# EAGLE schematic Projeto_Relogio_LED (EAGLE 9.6.2)
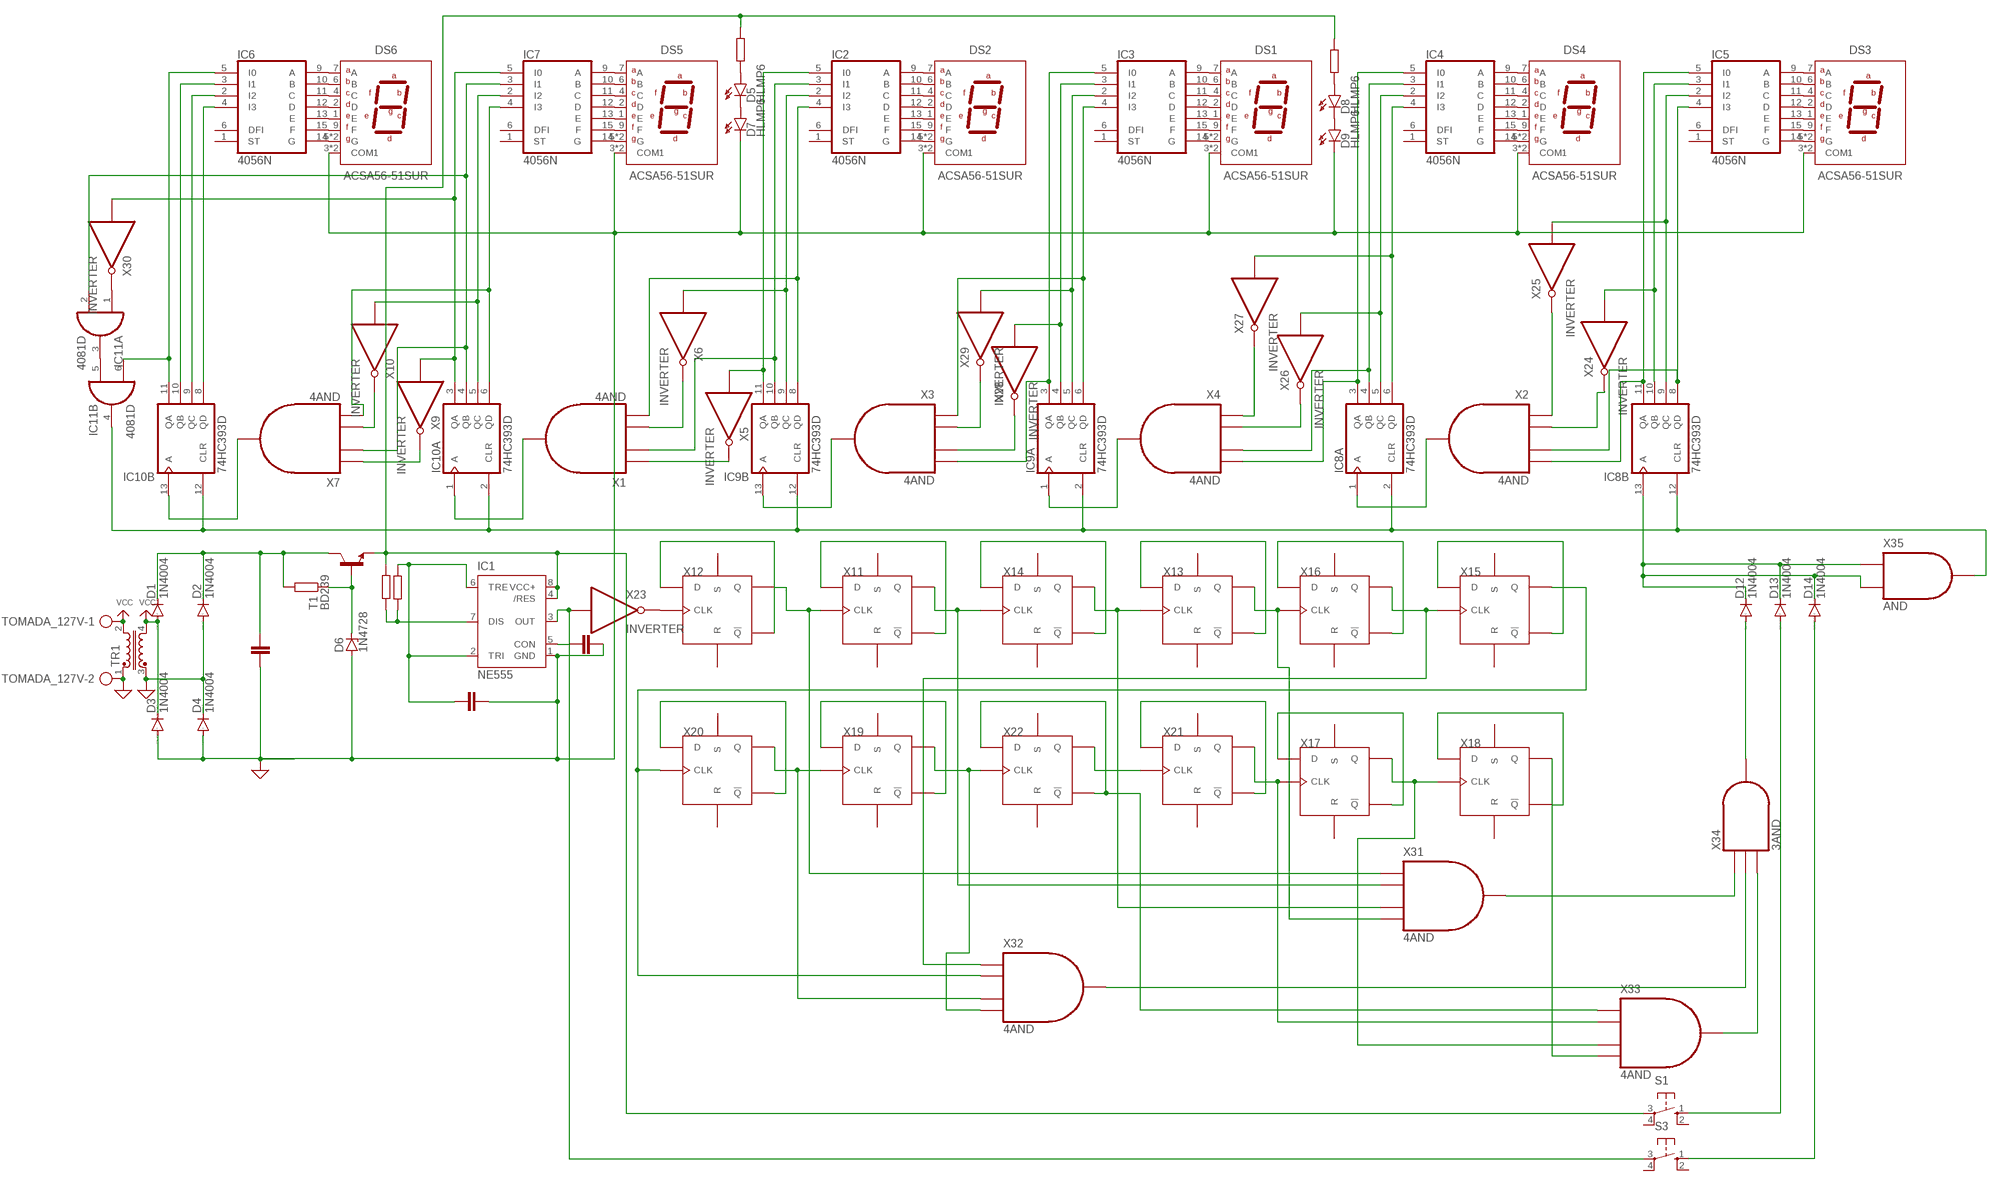
[diagram p0: schematic, sheet 1]

## Parts
D1  1N4004  [DO41-10]
D2  1N4004  [DO41-10]
D3  1N4004  [DO41-10]
D4  1N4004  [DO41-10]
D5  HLMP6  [HLMP6]
D6  1N4728  [DO41Z10]
D7  HLMP6  [HLMP6]
D8  HLMP6  [HLMP6]
D9  HLMP6  [HLMP6]
D12  1N4004  [DO41-10]
D13  1N4004  [DO41-10]
D14  1N4004  [DO41-10]
DS1  ACSA56-51SUR  [ACSA56-51SURKWA]
DS2  ACSA56-51SUR  [ACSA56-51SURKWA]
DS3  ACSA56-51SUR  [ACSA56-51SURKWA]
DS4  ACSA56-51SUR  [ACSA56-51SURKWA]
DS5  ACSA56-51SUR  [ACSA56-51SURKWA]
DS6  ACSA56-51SUR  [ACSA56-51SURKWA]
IC1  NE555  [DIL-08]
IC2  4056N  [DIL16]
IC3  4056N  [DIL16]
IC4  4056N  [DIL16]
IC5  4056N  [DIL16]
IC6  4056N  [DIL16]
IC7  4056N  [DIL16]
IC8  74HC393D  [SO14]
IC9  74HC393D  [SO14]
IC10  74HC393D  [SO14]
IC11  4081D  [SO14]
S1  10-XX  [B3F-10XX]
S3  10-XX  [B3F-10XX]
T1  BD239  [TO220]
TOMADA_127V  AK500/2-H  [AK500/2-H]
TR1  U15-TRANSFORMER  [U15]
X1  4AND  (no package)
X2  4AND  (no package)
X3  4AND  (no package)
X4  4AND  (no package)
X5  INVERTER  (no package)
X6  INVERTER  (no package)
X7  4AND  (no package)
X9  INVERTER  (no package)
X10  INVERTER  (no package)
X11  DFF  (no package)
X12  DFF  (no package)
X13  DFF  (no package)
X14  DFF  (no package)
X15  DFF  (no package)
X16  DFF  (no package)
X17  DFF  (no package)
X18  DFF  (no package)
X19  DFF  (no package)
X20  DFF  (no package)
X21  DFF  (no package)
X22  DFF  (no package)
X23  INVERTER  (no package)
X24  INVERTER  (no package)
X25  INVERTER  (no package)
X26  INVERTER  (no package)
X27  INVERTER  (no package)
X28  INVERTER  (no package)
X29  INVERTER  (no package)
X30  INVERTER  (no package)
X31  4AND  (no package)
X32  4AND  (no package)
X33  4AND  (no package)
X34  3AND  (no package)
X35  AND  (no package)

## Nets
GND: D2.A D3.A D4.A D4.C D6.A D7.K D9.K DS1.3(COM1) DS1.8(COM1) DS2.3(COM1) DS2.8(COM1) DS3.3(COM1) DS3.8(COM1) DS4.3(COM1) DS4.8(COM1) DS5.3(COM1) DS5.8(COM1) DS6.3(COM1) DS6.8(COM1) IC1.1(GND) TOMADA_127V.2 TR1.1 TR1.3 ; supply symbol labelled SUP
N$1: IC10.1(A:A) X1.Y
N$2: X1.A X5.O
N$3: IC8.1(A:A) X2.Y
N$4: D1.C D2.C T1.2(C)
N$5: IC1.7(DIS)
N$6: IC1.2(TRI) IC1.6(TRE)
N$7: D6.C T1.1(B)
N$8: IC1.5(CON)
N$9: IC1.3(OUT) S3.3(P) X23.I
N$10: X11.CLK X12.Q X31.A
N$11: X11.Q X14.CLK X31.B
N$12: X13.CLK X14.Q X31.C
N$13: X13.Q X16.CLK X31.D
N$14: X15.CLK X16.Q X32.A
N$15: X15.Q X20.CLK X32.B
N$16: X19.CLK X20.Q X32.C
N$17: X19.Q X22.CLK X32.D
N$18: X21.CLK X22.Q
N$19: X17.CLK X21.Q X33.B
N$20: X17.Q X18.CLK X33.C
N$21: DS5.7(A) IC7.9(A)
N$22: DS5.6(B) IC7.10(B)
N$23: DS5.4(C) IC7.11(C)
N$24: DS5.2(D) IC7.12(D)
N$25: DS5.1(E) IC7.13(E)
N$26: DS5.5(G) DS5.10(G) IC7.14(G)
N$27: DS5.9(F) IC7.15(F)
N$28: DS6.7(A) IC6.9(A)
N$29: DS6.6(B) IC6.10(B)
N$30: DS6.4(C) IC6.11(C)
N$31: DS6.2(D) IC6.12(D)
N$32: DS6.1(E) IC6.13(E)
N$33: DS6.5(G) DS6.10(G) IC6.14(G)
N$34: DS6.9(F) IC6.15(F)
N$35: DS3.7(A) IC5.9(A)
N$36: DS3.6(B) IC5.10(B)
N$37: DS3.4(C) IC5.11(C)
N$38: DS3.2(D) IC5.12(D)
N$39: DS3.1(E) IC5.13(E)
N$40: DS3.5(G) DS3.10(G) IC5.14(G)
N$41: DS3.9(F) IC5.15(F)
N$42: DS4.7(A) IC4.9(A)
N$43: DS4.6(B) IC4.10(B)
N$44: DS4.4(C) IC4.11(C)
N$45: DS4.2(D) IC4.12(D)
N$46: DS4.1(E) IC4.13(E)
N$47: DS4.5(G) DS4.10(G) IC4.14(G)
N$48: DS4.9(F) IC4.15(F)
N$49: DS1.7(A) IC3.9(A)
N$50: DS1.6(B) IC3.10(B)
N$51: DS1.4(C) IC3.11(C)
N$52: DS1.2(D) IC3.12(D)
N$53: DS1.1(E) IC3.13(E)
N$54: DS1.5(G) DS1.10(G) IC3.14(G)
N$55: DS1.9(F) IC3.15(F)
N$56: DS2.7(A) IC2.9(A)
N$57: DS2.6(B) IC2.10(B)
N$58: DS2.4(C) IC2.11(C)
N$59: DS2.2(D) IC2.12(D)
N$60: DS2.1(E) IC2.13(E)
N$61: DS2.5(G) DS2.10(G) IC2.14(G)
N$62: DS2.9(F) IC2.15(F)
N$63: IC4.4(I3) IC8.6(A:QD) X27.I
N$64: IC4.2(I2) IC8.5(A:QC) X26.I
N$65: IC4.3(I1) IC8.4(A:QB) X4.C
N$66: IC4.5(I0) IC8.3(A:QA) X4.D
N$67: IC5.4(I3) IC8.8(B:QD) X2.C
N$68: IC5.2(I2) IC8.9(B:QC) X25.I
N$69: IC5.3(I1) IC8.10(B:QB) X24.I
N$70: IC5.5(I0) IC8.11(B:QA) X2.D
N$71: IC3.4(I3) IC9.6(A:QD) X3.A
N$72: IC3.2(I2) IC9.5(A:QC) X29.I
N$73: IC3.3(I1) IC9.4(A:QB) X28.I
N$74: IC3.5(I0) IC9.3(A:QA) X3.D
N$75: IC2.4(I3) IC9.8(B:QD) X1.D
N$76: IC2.2(I2) IC9.9(B:QC) X6.I
N$77: IC2.3(I1) IC9.10(B:QB) X1.B
N$78: IC2.5(I0) IC9.11(B:QA) X5.I
N$79: IC7.4(I3) IC10.6(A:QD) X7.D
N$80: IC7.2(I2) IC10.5(A:QC) X10.I
N$81: IC7.3(I1) IC10.4(A:QB) IC11.2(A:I1) X7.B
N$82: IC7.5(I0) IC10.3(A:QA) X9.I X30.I
N$83: IC6.4(I3) IC10.8(B:QD)
N$84: IC6.2(I2) IC10.9(B:QC)
N$85: IC6.3(I1) IC10.10(B:QB)
N$86: IC6.5(I0) IC10.11(B:QA) IC11.6(B:I1)
N$87: D5.K D7.A
N$88: D8.K D9.A
N$89: X12.CLK X23.O
N$90: D12.A X34.Y
N$91: X1.C X6.O
N$92: X7.A X9.O
N$93: X12.!Q X12.D
N$94: X11.!Q X11.D
N$95: X14.!Q X14.D
N$96: X13.!Q X13.D
N$97: X16.!Q X16.D
N$98: X15.!Q X15.D
N$99: X18.!Q X18.D
N$100: X17.!Q X17.D
N$101: X21.!Q X21.D
N$102: X22.!Q X22.D X33.A
N$103: X20.!Q X20.D
N$104: X19.!Q X19.D
N$105: D12.C D13.C D14.C IC8.13(B:A) X35.A X35.B
N$106: X31.Y X34.A
N$107: IC1.4(/RES) IC1.8(VCC+) S1.3(P) T1.3(E)
N$108: D13.A S1.1(S)
N$109: D14.A S3.1(S)
N$110: X32.Y X34.B
N$111: IC8.2(A:CLR) IC8.12(B:CLR) IC9.2(A:CLR) IC9.12(B:CLR) IC10.2(A:CLR) IC10.12(B:CLR) IC11.4(B:O) X35.Y
N$112: X2.B X24.O
N$113: X2.A X25.O
N$114: IC9.1(A:A) X4.Y
N$115: X4.B X26.O
N$116: X4.A X27.O
N$117: IC9.13(B:A) X3.Y
N$118: X3.C X28.O
N$119: X3.B X29.O
N$120: IC11.1(A:I0) X30.O
N$121: X7.C X10.O
N$122: IC10.13(B:A) X7.Y
N$123: IC11.3(A:O) IC11.5(B:I0)
N$124: X33.Y X34.C
N$125: X18.Q X33.D
VCC: D1.A D3.C TOMADA_127V.1 TR1.2 TR1.4
Unconnected: D5.A D8.A IC2.1(ST) IC2.6(DFI) IC3.1(ST) IC3.6(DFI) IC4.1(ST) IC4.6(DFI) IC5.1(ST) IC5.6(DFI) IC6.1(ST) IC6.6(DFI) IC7.1(ST) IC7.6(DFI) IC11.8(C:I0) IC11.9(C:I1) IC11.10(C:O) IC11.11(D:O) IC11.12(D:I0) IC11.13(D:I1) S1.2(S1) S1.4(P1) S3.2(S1) S3.4(P1) X11.R X11.S X12.R X12.S X13.R X13.S X14.R X14.S X15.R X15.S X16.R X16.S X17.R X17.S X18.R X18.S X19.R X19.S X20.R X20.S X21.R X21.S X22.R X22.S

## Power pins joined to a net without a drawn wire
GND: IC2.8(GND) IC3.8(GND) IC4.8(GND) IC5.8(GND) IC6.8(GND) IC7.8(GND) IC8.7(P:GND) IC9.7(P:GND) IC10.7(P:GND)
VCC: IC2.16(VCC) IC3.16(VCC) IC4.16(VCC) IC5.16(VCC) IC6.16(VCC) IC7.16(VCC) IC8.14(P:VCC) IC9.14(P:VCC) IC10.14(P:VCC)
VDD: IC11.14(P:VDD)
VEE: IC2.7(VEE) IC3.7(VEE) IC4.7(VEE) IC5.7(VEE) IC6.7(VEE) IC7.7(VEE)
VSS: IC11.7(P:VSS)

## Library data of the parts
D1-D4 D12-D14 = diode:1N4004: DIODE general purpose rectifier, 1 A
D5 D7-D9 = display-hp:HLMP6: LED 2mm horizontal; MF: AGILENT TECHNOLOGIES; MPN: HLMP-6500; OC_FARNELL: 1652490; OC_NEWARK: 40K0088
D6 = diode:1N4728: Z DIODE 3.3 V, 1W, 5 percent
DS1-DS6 = Display_LED:ACSA56-51SUR: Single Digit Numeric Display - 7SEG - 0.56 inch Character size - Red - 10SMD Datasheet <https://www.kingbrightusa.com/images/catalog/SPEC/ACSA56-51SURKWA.pdf>; CATEGORY: Display Modules; COLOR: Red; CONFIGURATION: Common Anode; DATASHEET: https://www.kingbrightusa.com/images/catalog/SPEC/ACSA56-51SURKWA.pdf; DESCRIPTION: 0.56" Single Digit Common Anode Red SMD LED Display; DIGIT: 1 Digit; MANUFACTURER: Kingbright; MPN: ACSA56-51SURKWA; OPERATING_TEMPERATURE: -40°C ~ 85°C; PACKAGE_SIZE: 12-SMD No Lead; PACKAGE_TYPE: SMD; PART_STATUS: ACTIVE; ROHS: COMPLIANT; SERIES: ACSA56; SUBCATEGORY: LED Character and Numeric; THERMALLOSS: 0.075 W; TYPE: 7-Segment
IC1 = st-microelectronics:NE555: General purpose bipolar Timer; MF: Arrow Electronics; MPN: NE555N; OC_FARNELL: 1467742; OC_NEWARK: 89K1486
IC2-IC7 = 40xx:4056: BCD to 7-segment LCD DECODER/DRIVER
IC8-IC10 = 74xx-eu:74*393: Dual 4-bit decade and binary COUNTER
IC11 = 40xx:4081: Quad 2-input AND
S1 S3 = switch-omron:10-XX: OMRON SWITCH; MPN: B3F-1000; OC_FARNELL: 176432; OC_NEWARK: 36M3542
T1 = transistor:BD239: NPN TRANSISTOR Source: http://www.fairchildsemi.com/ds/BD/BD239C.pdf
TOMADA_127V = con-ptr500:AK500/2-H: CONNECTOR Aug. 2004 / PTR Meßtechnik: Die Bezeichnung der Serie AK505 wurde geändert. Es handelt sich hierbei um AK500 in horizontaler Ausführung.; OC_FARNELL: unknown; OC_NEWARK: unknown
TR1 = inductor-neosid:U15: TRANSFORMER U15; OC_FARNELL: unknown; OC_NEWARK: unknown
X1-X4 X7 X31-X33 = ngspice-digital:4AND: 4 input logic AND gate
X5 X6 X9 X10 X23-X30 = ngspice-digital:INVERTER: logic inverter (NOT gate)
X11-X22 = ngspice-digital:DFF: D TYPE FLIP FLOP
X34 = ngspice-digital:3AND: 3 input logic AND gate
X35 = ngspice-digital:AND: 2 input logic AND gate